# Altium schematic sheet Braking.SchDoc
size 330 x 381 mm
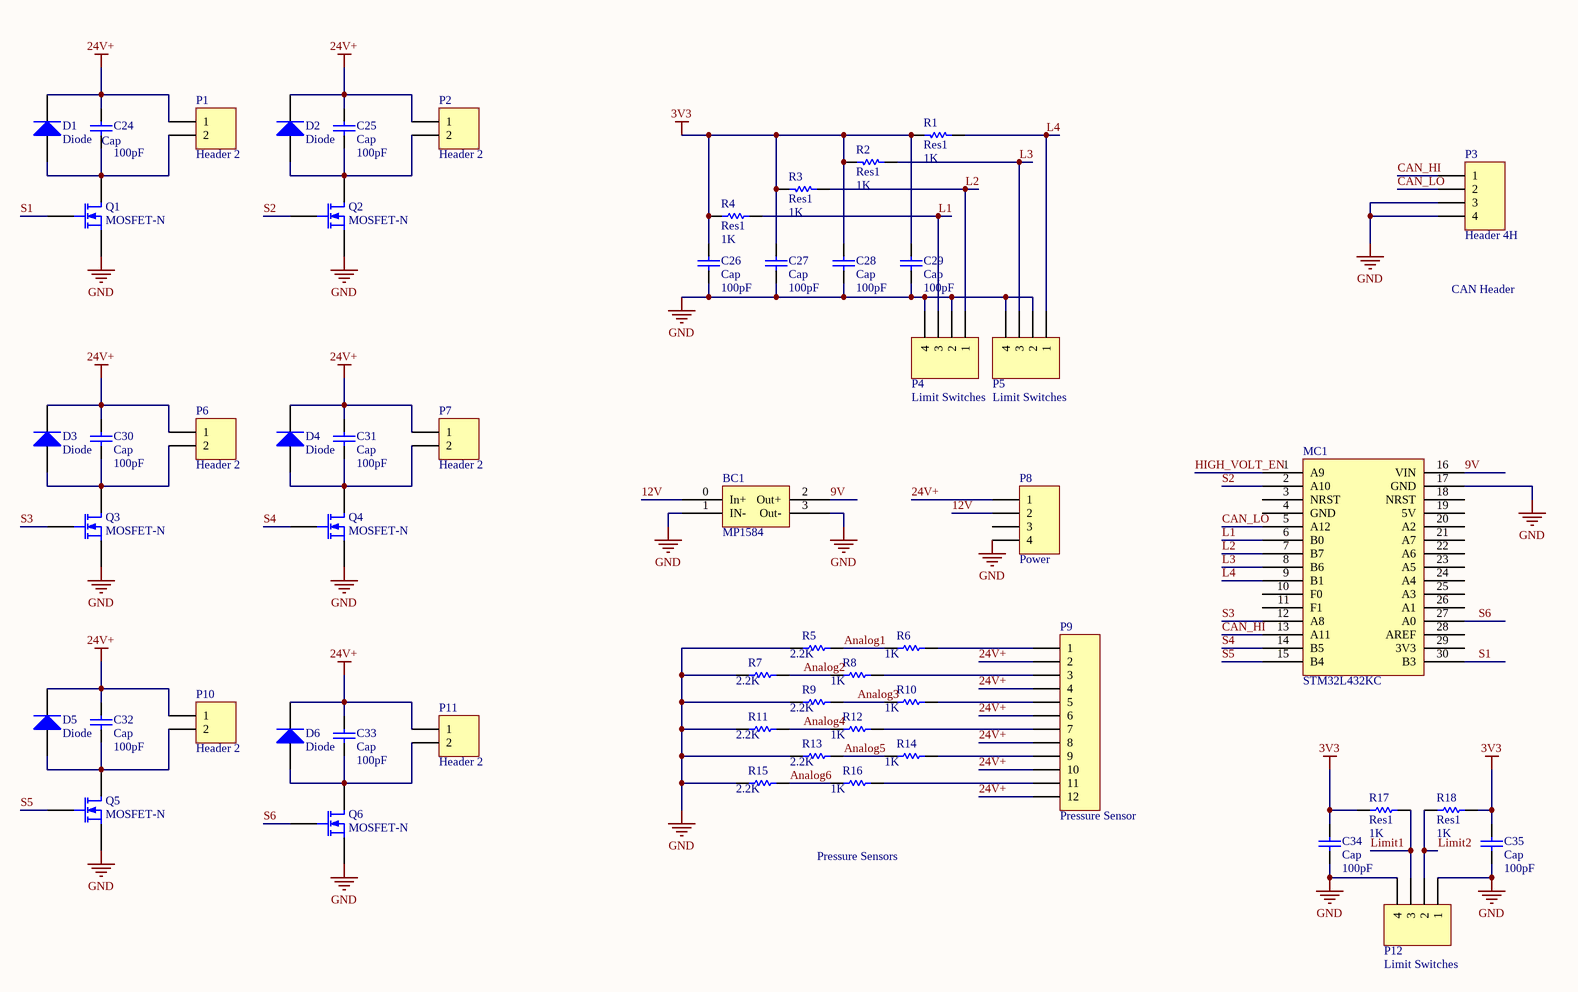
[diagram p0: Braking.SchDoc]

## Parts
BC1  MP1584
C24  Cap  value 100pF  [RAD-0.3]
C25  Cap  value 100pF  [RAD-0.3]
C26  Cap  value 100pF  [RAD-0.3]
C27  Cap  value 100pF  [RAD-0.3]
C28  Cap  value 100pF  [RAD-0.3]
C29  Cap  value 100pF  [RAD-0.3]
C30  Cap  value 100pF  [RAD-0.3]
C31  Cap  value 100pF  [RAD-0.3]
C32  Cap  value 100pF  [RAD-0.3]
C33  Cap  value 100pF  [RAD-0.3]
C34  Cap  value 100pF  [RAD-0.3]
C35  Cap  value 100pF  [RAD-0.3]
D1  Diode  [SMC]
D2  Diode  [SMC]
D3  Diode  [SMC]
D4  Diode  [SMC]
D5  Diode  [SMC]
D6  Diode  [SMC]
MC1  STM32L432KC
P1  Header 2  [HDR1X2]
P2  Header 2  [HDR1X2]
P3  Header 4H  [HDR1X4H]
P4  Limit Switches  [HDR1X4]
P5  Limit Switches  [HDR1X4]
P6  Header 2  [HDR1X2]
P7  Header 2  [HDR1X2]
P8  Power  [HDR1X4]
P9  Pressure Sensor  [HDR1X12]
P10  Header 2  [HDR1X2]
P11  Header 2  [HDR1X2]
P12  Limit Switches  [HDR1X4]
Q1  MOSFET-N  [E3]
Q2  MOSFET-N  [E3]
Q3  MOSFET-N  [E3]
Q4  MOSFET-N  [E3]
Q5  MOSFET-N  [E3]
Q6  MOSFET-N  [E3]
R1  Res1  value 1K  [AXIAL-0.3]
R2  Res1  value 1K  [AXIAL-0.3]
R3  Res1  value 1K  [AXIAL-0.3]
R4  Res1  value 1K  [AXIAL-0.3]
R5  value 2.2K  [AXIAL-0.3]  (hidden comment: Res1)
R6  value 1K  [AXIAL-0.3]  (hidden comment: Res1)
R7  value 2.2K  [AXIAL-0.3]  (hidden comment: Res1)
R8  value 1K  [AXIAL-0.3]  (hidden comment: Res1)
R9  value 2.2K  [AXIAL-0.3]  (hidden comment: Res1)
R10  value 1K  [AXIAL-0.3]  (hidden comment: Res1)
R11  value 2.2K  [AXIAL-0.3]  (hidden comment: Res1)
R12  value 1K  [AXIAL-0.3]  (hidden comment: Res1)
R13  value 2.2K  [AXIAL-0.3]  (hidden comment: Res1)
R14  value 1K  [AXIAL-0.3]  (hidden comment: Res1)
R15  value 2.2K  [AXIAL-0.3]  (hidden comment: Res1)
R16  value 1K  [AXIAL-0.3]  (hidden comment: Res1)
R17  Res1  value 1K  [AXIAL-0.3]
R18  Res1  value 1K  [AXIAL-0.3]

## Nets
3V3: C26.2 C27.2 C28.2 C29.2 C34.2 C35.2 R1.2 R2.2 R3.2 R4.1 R17.1 R18.2
24V+: C24.1 C25.1 C30.1 C31.1 C32.1 C33.1 D1.2(K) D2.2(K) D3.2(K) D4.2(K) D5.2(K) D6.2(K) P1.1 P2.1 P6.1 P7.1 P8.1 P9.2 P9.4 P9.6 P9.8 P9.10 P9.12 P10.1 P11.1
GND: BC1.1(IN-) BC1.3(Out-) C26.1 C27.1 C28.1 C29.1 C34.1 C35.1 MC1.17(GND) P3.3 P3.4 P4.2 P4.4 P5.2 P5.4 P8.4 P12.1 P12.4 Q1.3(S) Q2.3(S) Q3.3(S) Q4.3(S) Q5.3(S) Q6.3(S) R5.1 R7.1 R9.1 R11.1 R13.1 R15.1
9V: BC1.2(Out+) MC1.16(VIN)
12V: BC1.0(In+) P8.2
Analog1: R5.2 R6.1
Analog2: R7.2 R8.1
Analog3: R9.2 R10.1
Analog4: R11.2 R12.1
Analog5: R13.2 R14.1
Analog6: R15.2 R16.1
CAN_HI: MC1.13(A11) P3.1
CAN_LO: MC1.5(A12) P3.2
HIGH_VOLT_EN: MC1.1(A9)
L1: MC1.6(B0) P4.3 R4.2
L2: MC1.7(B7) P4.1 R3.1
L3: MC1.8(B6) P5.3 R2.1
L4: MC1.9(B1) P5.1 R1.1
Limit1: P12.3 R17.2
Limit2: P12.2 R18.1
S1: MC1.30(B3) Q1.2(G)
S2: MC1.2(A10) Q2.2(G)
S3: MC1.12(A8) Q3.2(G)
S4: MC1.14(B5) Q4.2(G)
S5: MC1.15(B4) Q5.2(G)
S6: MC1.27(A0) Q6.2(G)
NetC24_2: C24.2 D1.1(A) P1.2 Q1.1(D)
NetC25_2: C25.2 D2.1(A) P2.2 Q2.1(D)
NetC30_2: C30.2 D3.1(A) P6.2 Q3.1(D)
NetC31_2: C31.2 D4.1(A) P7.2 Q4.1(D)
NetC32_2: C32.2 D5.1(A) P10.2 Q5.1(D)
NetC33_2: C33.2 D6.1(A) P11.2 Q6.1(D)
NetP9_1: P9.1 R6.2
NetP9_3: P9.3 R8.2
NetP9_5: P9.5 R10.2
NetP9_7: P9.7 R12.2
NetP9_9: P9.9 R14.2
NetP9_11: P9.11 R16.2

Not connected (* = marked no-connect by the designer): MC1 3(NRST) 4(GND) 10(F0) 11(F1) 18(NRST) 19(5V) 20(A2) 21(A7) 22(A6) 23(A5) 24(A4) 25(A3) 26(A1) 28(AREF) 29(3V3); P8 3

## Notes on the sheet
- CAN Header
- Pressure Sensors

## Library data of the parts
C24-C35 = Cap: Capacitor; Published: 8-Jun-2000; LatestRevisionDate: 17-Jul-2002; LatestRevisionNote: Re-released for DXP Platform.; PackageReference: RAD-0.3; Publisher: Altium Limited; PackageDescription: Radial Cap, Thru-Hole; 2 Leads; 0.3 in Pin Spacing
D1-D6 = Diode: Default Diode; Published: 8-Jun-2000; LatestRevisionDate: 17-Jul-2002; LatestRevisionNote: Re-released for DXP Platform.; PackageVersion: Sep-1996; PackageReference: SMC; Publisher: Altium Limited; PackageDescription: DO-214-AB/SMC; 2 C-Bend Leads; Body 7.9 x 5.9 mm, inc. leads (LxW); Code_JEDEC: DO-214-AB
MC1 = STMF303K8
P1 P2 P6 P7 P10 P11 = Header 2: Header, 2-Pin; LatestRevisionDate: 17-Jul-2002; LatestRevisionNote: Re-released for DXP Platform.; Publisher: Altium Limited
P3 = Header 4H: Header, 4-Pin, Right Angle; LatestRevisionDate: 17-Jul-2002; LatestRevisionNote: Re-released for DXP Platform.; Publisher: Altium Limited
P4 P5 P8 P12 = Header 4: Header, 4-Pin; LatestRevisionDate: 17-Jul-2002; LatestRevisionNote: Re-released for DXP Platform.; Publisher: Altium Limited
P9 = Header 12: Header, 12-Pin; LatestRevisionDate: 17-Jul-2002; LatestRevisionNote: Re-released for DXP Platform.; Publisher: Altium Limited
Q1-Q6 = MOSFET-N: N-Channel MOSFET; Published: 8-Jun-2000; LatestRevisionDate: 17-Jul-2002; LatestRevisionNote: Re-released for DXP Platform.; PackageVersion: 1995/1996; PackageReference: E3; Publisher: Altium Limited; PackageDescription: TO, Flat Index; 3 In-Line, Axial Leads; Body Dia. 4.6mm; Lead Dia. 0.5 mm (max)
R1-R18 = Res1: Resistor; Published: 8-Jun-2000; LatestRevisionDate: 17-Jul-2002; LatestRevisionNote: Re-released for DXP Platform.; PackageReference: AXIAL-0.3; Publisher: Altium Limited; PackageDescription: Axial Device, Thru-Hole; 2 Leads; 0.3 in Pin Spacing